# EAGLE schematic spotwelder (EAGLE 6.5.0)
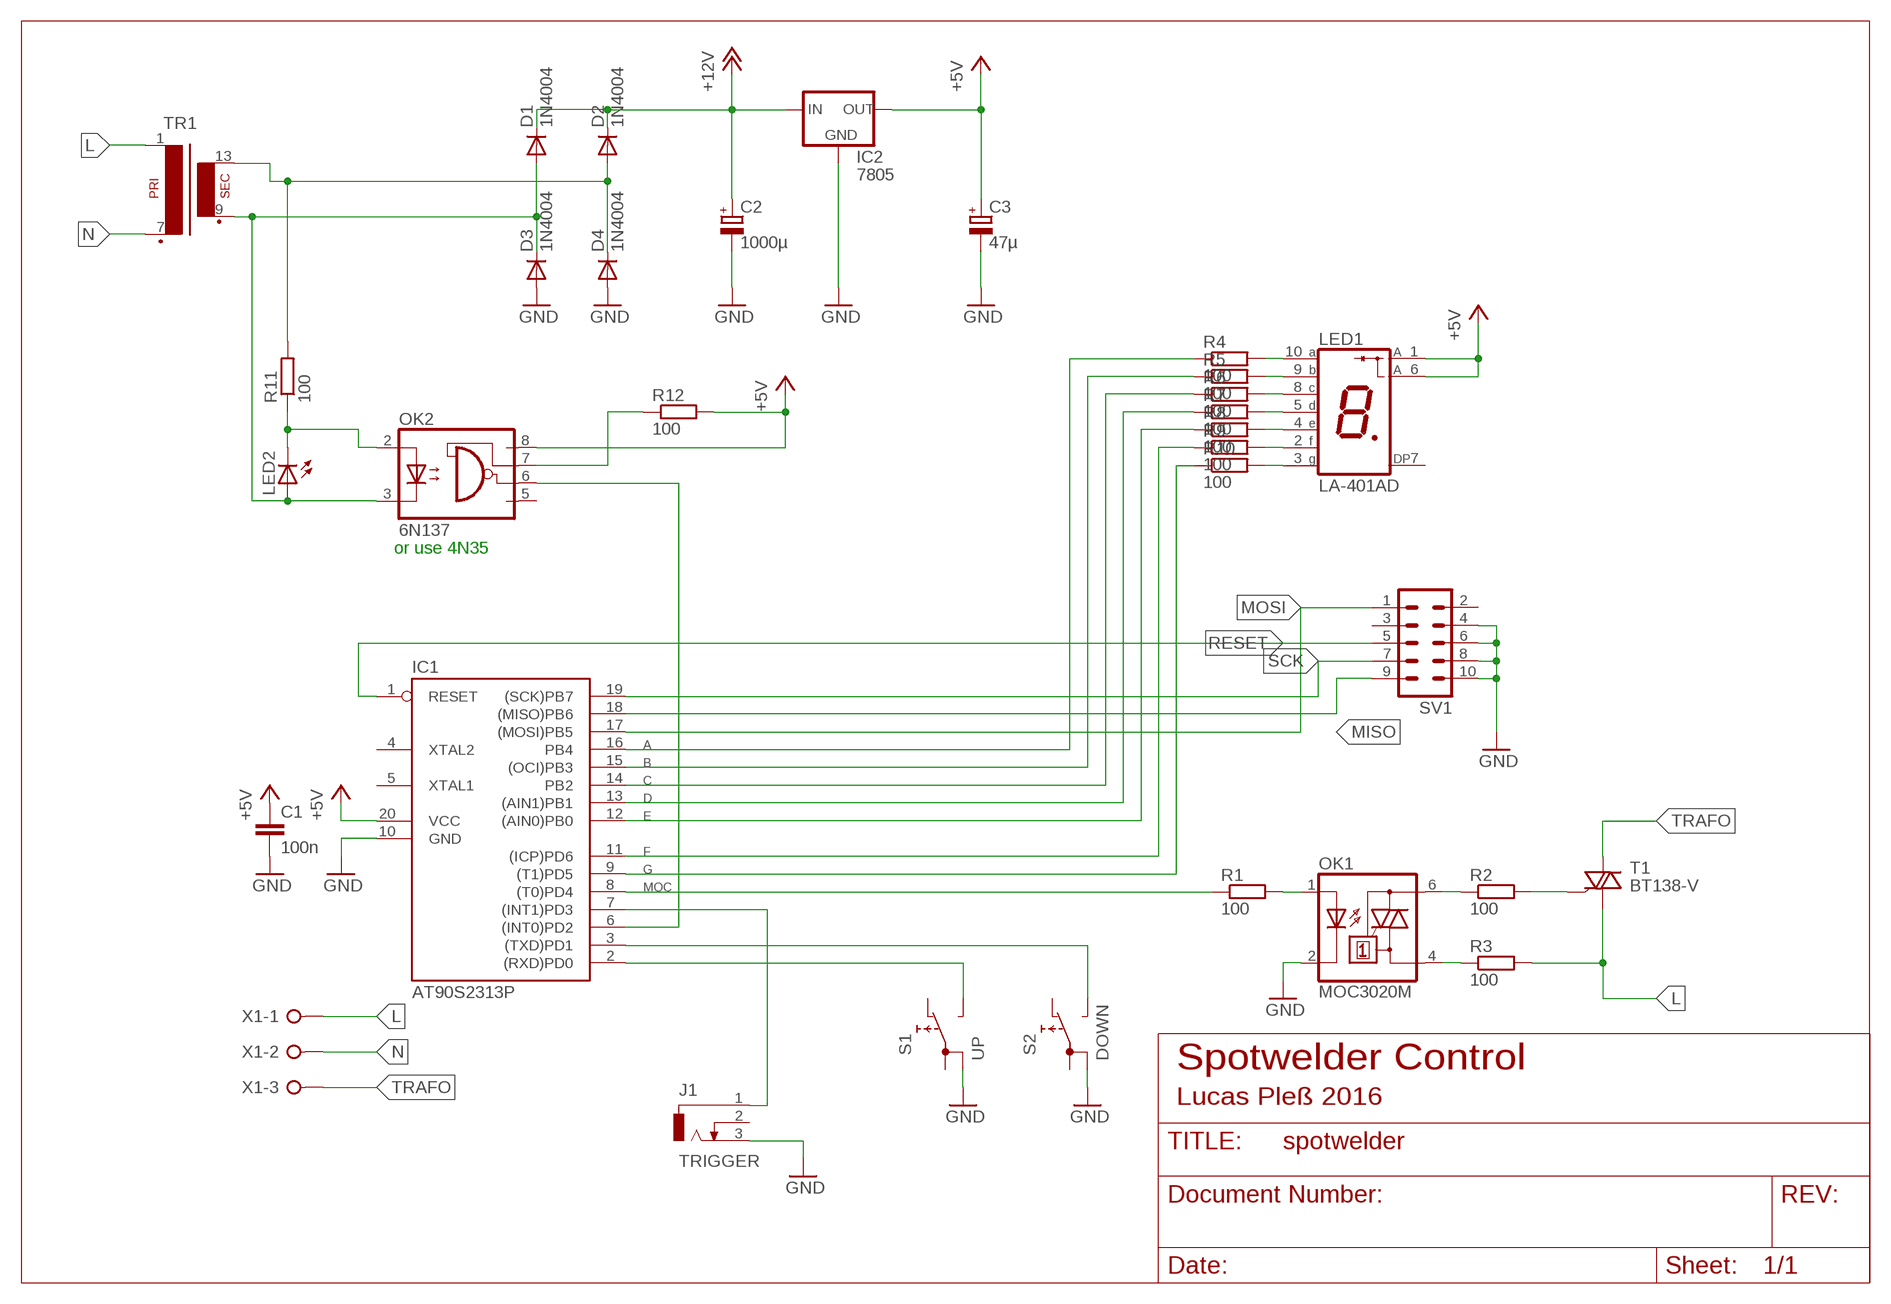
[diagram p0: schematic, sheet 1]

## Parts
C1  100n  C-EU025-025X050  [C025-025X050]
C2  1000µ  CPOL-EUE2.5-5  [E2,5-5]
C3  47µ  CPOL-EUE2.5-5  [E2,5-5]
D1  1N4004  [DO41-10]
D2  1N4004  [DO41-10]
D3  1N4004  [DO41-10]
D4  1N4004  [DO41-10]
IC1  AT90S2313P  [DIL20]
IC2  7805  78XXS  [78XXS]
J1  TRIGGER  DCJ0202  [DCJ0202]
LED1  LA-401AD  [LA-401]
LED2  LED5MM  [LED5MM]
OK1  MOC3020M  [DIL06]
OK2  6N137  [DIL08]
R1  100  R-EU_0207/10  [0207/10]
R2  100  R-EU_0207/10  [0207/10]
R3  100  R-EU_0207/10  [0207/10]
R4  100  R-EU_0207/10  [0207/10]
R5  100  R-EU_0207/10  [0207/10]
R6  100  R-EU_0207/10  [0207/10]
R7  100  R-EU_0207/10  [0207/10]
R8  100  R-EU_0207/10  [0207/10]
R9  100  R-EU_0207/10  [0207/10]
R10  100  R-EU_0207/10  [0207/10]
R11  100  R-EU_0207/10  [0207/10]
R12  100  R-EU_0207/10  [0207/10]
S1  UP  5501  [5501]
S2  DOWN  5501  [5501]
SV1  ML10  [ML10]
T1  BT138-V  [TO220BV]
TR1  EI60-1  [EI60-1]
X1  W237-3E  [W237-3E]

## Nets
+5V: C1.1 C3.+ IC1.20(VCC) IC2.OUT LED1.1(A) LED1.6(A) OK2.8(VCC) R12.2
+12V: C2.+ D1.C D2.C IC2.IN
A: IC1.16(PB4) R4.1
B: IC1.15((OCI)PB3) R5.1
C: IC1.14(PB2) R6.1
D: IC1.13((AIN1)PB1) R7.1
E: IC1.12((AIN0)PB0) R8.1
F: IC1.11((ICP)PD6) R9.1
G: IC1.9((T1)PD5) R10.1
GND: C1.2 C2.- C3.- D3.A D4.A IC1.10(GND) IC2.GND J1.3 OK1.2(C) S1.1B S2.1B SV1.4 SV1.6 SV1.8 SV1.10
L: R3.2 T1.T1(A1) TR1.1 X1.1
MISO: IC1.18((MISO)PB6) SV1.9
MOC: IC1.8((T0)PD4) R1.1
MOSI: IC1.17((MOSI)PB5) SV1.1
N: TR1.7(P2) X1.2
N$1: OK1.4(A1) R3.1
N$2: OK1.6(A2) R2.1
N$3: R2.2 T1.G
N$4: OK1.1(A) R1.2
N$5: D1.A D3.C LED2.A OK2.3(C) TR1.9(S3)
N$7: D2.A D4.C R11.2 TR1.13(S4)
N$8: LED1.10(A) R4.2
N$9: LED1.9(B) R5.2
N$10: LED1.8(C) R6.2
N$11: LED1.5(D) R7.2
N$12: LED1.4(E) R8.2
N$13: LED1.2(F) R9.2
N$14: LED1.3(G) R10.2
N$15: LED2.K(C) OK2.2(A) R11.1
N$17: OK2.7(VE) R12.1
N$18: IC1.6((INT0)PD2) OK2.6(VO)
N$22: IC1.2((RXD)PD0) S1.NO
N$23: IC1.3((TXD)PD1) S2.NO
N$24: IC1.7((INT1)PD3) J1.1
RESET: IC1.1(RESET) SV1.5
SCK: IC1.19((SCK)PB7) SV1.7
TRAFO: T1.T2(A2) X1.3
Unconnected: IC1.4(XTAL2) IC1.5(XTAL1) J1.2 LED1.7(DP) OK2.5(GND) S1.1A S1.NC S2.1A S2.NC SV1.2 SV1.3

## Notes on the sheet
- or use 4N35
- Spotwelder Control
- Lucas Pleß 2016

## Library data of the parts
C1 = rcl:C-EU: CAPACITOR, European symbol
C2 C3 = rcl:CPOL-EU: POLARIZED CAPACITOR, European symbol
D1-D4 = diode:1N4004: DIODE general purpose rectifier, 1 A
IC1 = atmel:AT90S2313: MICROCONTROLLER 2 Kbytes FLASH 128 bytes SRAM 128 bytes EEPROM UART; OC_FARNELL: unknown; OC_NEWARK: unknown
IC2 = v-reg:78XXS: VOLTAGE REGULATOR
J1 = con-jack:DCJ0202: DC POWER JACK Source: DCJ0202.pdf; OC_FARNELL: unknown; OC_NEWARK: unknown
LED1 = led-7-segment:LA-401*D: Single Digit LED Numeric Display (anode common) Source: ROHM .. la-1401dn.pdf; OC_FARNELL: unknown; OC_NEWARK: unknown
LED2 = led:LED: LED OSRAM: - CHIPLED LG R971, LG N971, LY N971, LG Q971, LY Q971, LO R971, LY R971 LH N974, LH R974 LS Q976, LO Q976, LY Q976 LO Q996 - Hyper CHIPLED LW Q18S LB Q993, LB Q99A, LB R99A - SideLED LS A670, LO A670, LY A670, LG A670, LP A670 LB A673, LV A673, LT A673, LW A673 LH A674 LY A675 LS A676, LA A676, LO A676, LY A676, LW A676 LS A679, LY A679, LG A679 - Hyper Micro SIDELED® LS Y876, LA Y876, LO Y876, LY Y876 LT Y87S - SmartLED LW L88C, LW L88S LB L89C, LB L89S, LG L890 LS L89K, LO L89K, LY L89K LS L896, LA L896, LO L896, LY L896 - TOPLED LS T670, LO T670, LY T670, LG T670, LP T670 LSG T670, LSP T670, LSY T670, LOP T670, LYG T670 LG T671, LOG T671, LSG T671 LB T673, LV T673, LT T673, LW T673 LH T674 LS T676, LA T676, LO T676, LY T676, LB T676, LH T676, LSB T676, LW T676 LB T67C, LV T67C, LT T67C, LS T67K, LO T67K, LY T67K, LW E67C LS E67B, LA E67B, LO E67B, LY E67B, LB E67C, LV E67C, LT E67C LW T67C LS T679, LY T679, LG T679 LS T770, LO T770, LY T770, LG T770, LP T770 LB T773, LV T773, LT T773, LW T773 LH T774 LS E675, LA E675, LY E675, LS T675 LS T776, LA T776, LO T776, LY T776, LB T776 LHGB T686 LT T68C, LB T68C - Hyper Mini TOPLED® LB M676 - Mini TOPLED Santana® LG M470 LS M47K, LO M47K, LY M47K Source: http://www.osram.convergy.de LUXEON: - LUMILED® LXK2-PW12-R00, LXK2-PW12-S00, LXK2-PW14-U00, LXK2-PW14-V00 LXK2-PM12-R00, LXK2-PM12-S00, LXK2-PM14-U00 LXK2-PE12-Q00, LXK2-PE12-R00, LXK2-PE12-S00, LXK2-PE14-T00, LXK2-PE14-U00 LXK2-PB12-K00, LXK2-PB12-L00, LXK2-PB12-M00, LXK2-PB14-N00, LXK2-PB14-P00, LXK2-PB14-Q00 LXK2-PR12-L00, LXK2-PR12-M00, LXK2-PR14-Q00, LXK2-PR14-R00 LXK2-PD12-Q00, LXK2-PD12-R00, LXK2-PD12-S00 LXK2-PH12-R00, LXK2-PH12-S00 LXK2-PL12-P00, LXK2-PL12-Q00, LXK2-PL12-R00 Source: www.luxeon.com KINGBRIGHT: KA-3528ASYC Source: www.kingbright.com
OK1 = optocoupler:MOC30*M: RANDOM-PHASE OPTOISOLATORS TRIAC DRIVER OUTPUT Source: http://www.fairchildsemi.com MOC3020-M.pdf; MF: FAIRCHILD SEMICONDUCTOR; MPN: MOC3020-M; OC_FARNELL: 1505425; OC_NEWARK: 72K8895
OK2 = optocoupler:6N137: MOTOROLA OPTO COUPLER; MPN: 6N137; OC_FARNELL: 1328376; OC_NEWARK: 52M1895
R1-R12 = rcl:R-EU_: RESISTOR, European symbol
S1 S2 = switch:55?: PUSHBUTTON SERIES 5500 SWITCHES Source: www.e-switch.com .. 5500.pdf
SV1 = con-harting-ml:ML10: HARTING; OC_FARNELL: unknown; OC_NEWARK: unknown
T1 = triac:BT138: TRIAC Source: http://www.semiconductors.philips.com BT138_SERIES_2.pdf
TR1 = trafo:EI60-1: TRANSFORMER 1 primary winding, 1 secondary winding, mounting holes ERA
X1 = con-wago-508:W237-3E: WAGO SREW CLAMP; OC_FARNELL: unknown; OC_NEWARK: unknown